# EAGLE design amp128-v5 (EAGLE 6.4)
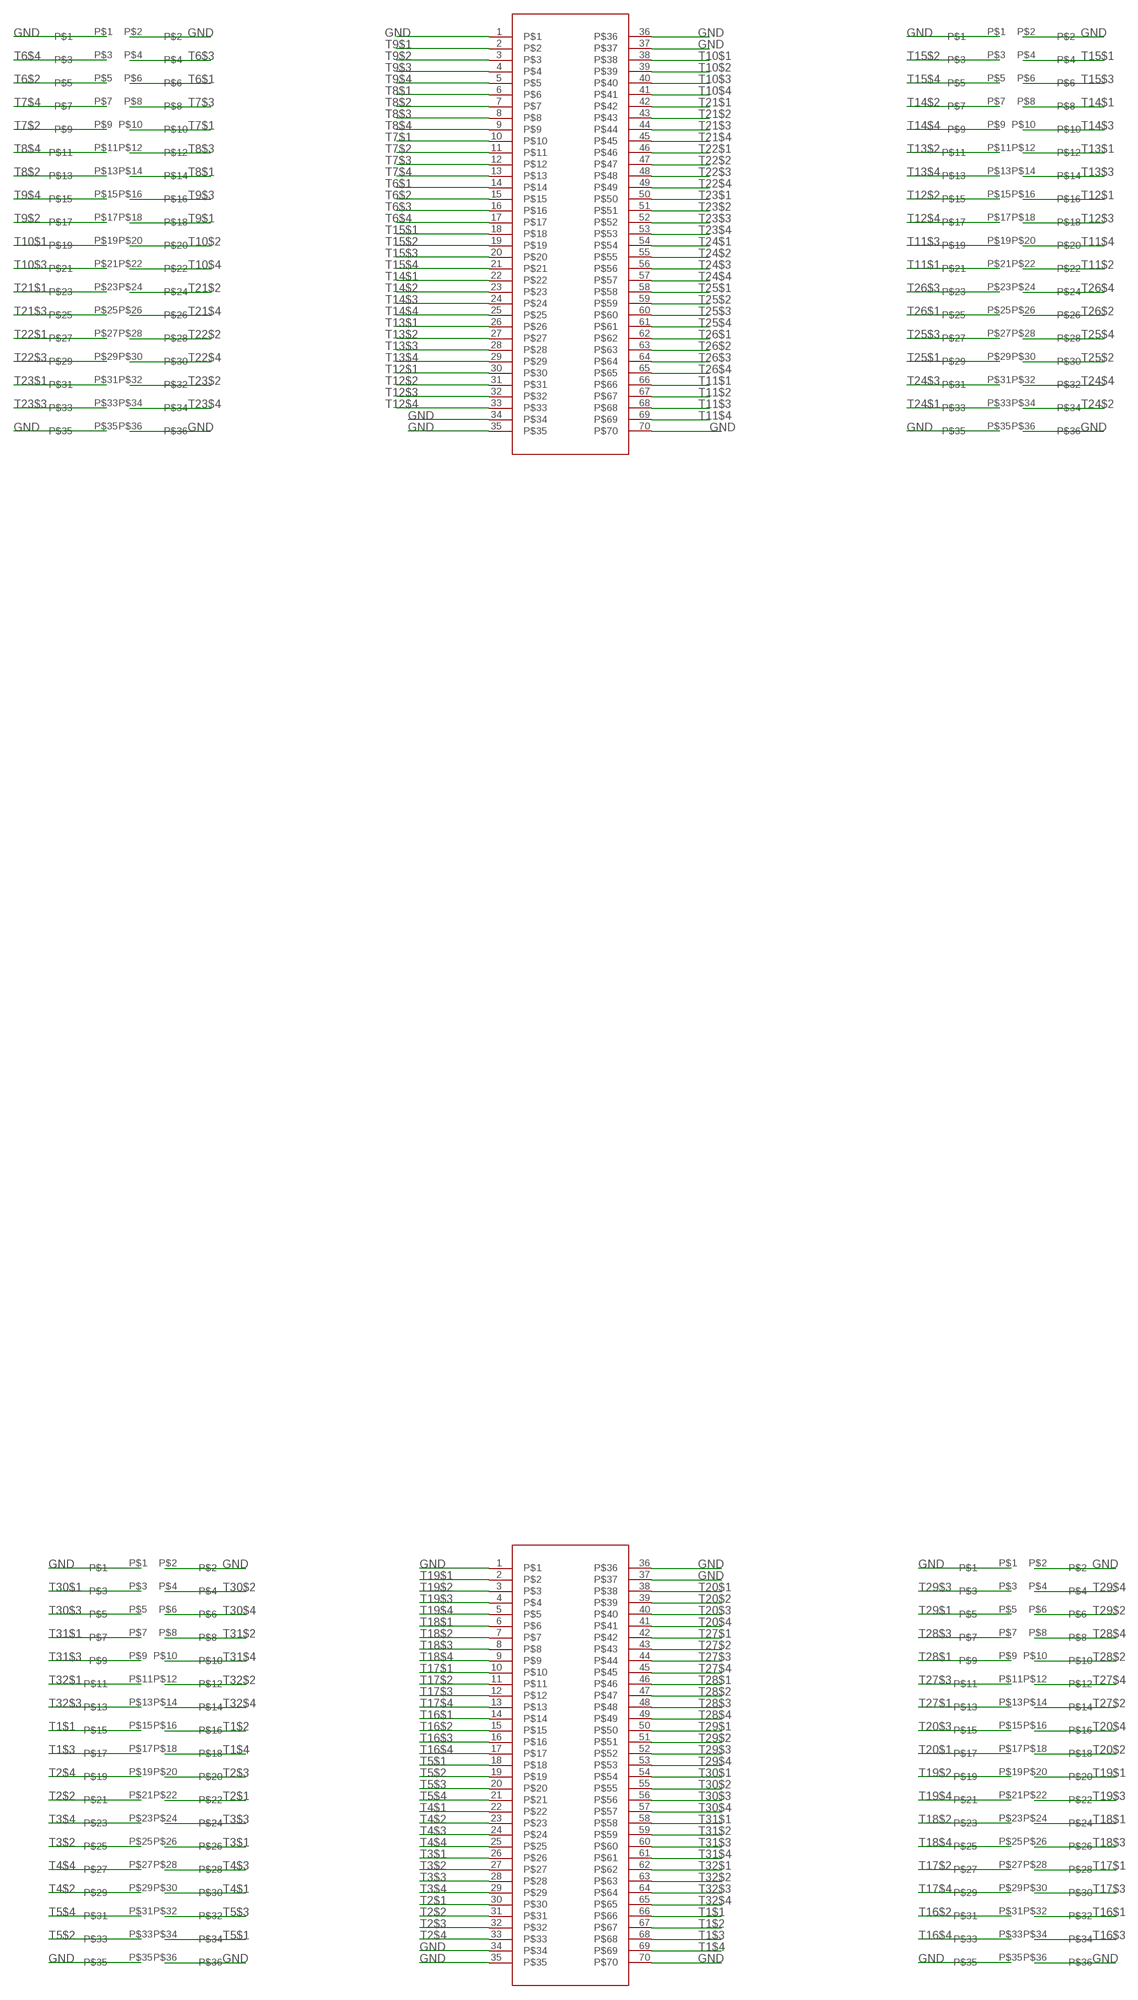
[diagram p0: schematic, sheet 1]

## Parts
U$1  DF40C-70DS  [DF40C-70DS]
U$2  DF40C-70DS  [DF40C-70DS]
U$3  MILL-MAX2BY18  [MILL-MAX2BY18]
U$4  MILL-MAX2BY18  [MILL-MAX2BY18]
U$5  MILL-MAX2BY18  [MILL-MAX2BY18]
U$6  MILL-MAX2BY18  [MILL-MAX2BY18]

## Nets
GND: U$1.1 U$1.34 U$1.35 U$1.36 U$1.37 U$1.70 U$2.1 U$2.34 U$2.35 U$2.36 U$2.37 U$2.70 U$3.P$1 U$3.P$2 U$3.P$35 U$3.P$36 U$4.P$1 U$4.P$2 U$4.P$35 U$4.P$36 U$5.P$1 U$5.P$2 U$5.P$35 U$5.P$36 U$6.P$1 U$6.P$2 U$6.P$35 U$6.P$36
T1$1: U$2.66 U$5.P$15
T1$2: U$2.67 U$5.P$16
T1$3: U$2.68 U$5.P$17
T1$4: U$2.69 U$5.P$18
T2$1: U$2.30 U$5.P$22
T2$2: U$2.31 U$5.P$21
T2$3: U$2.32 U$5.P$20
T2$4: U$2.33 U$5.P$19
T3$1: U$2.26 U$5.P$26
T3$2: U$2.27 U$5.P$25
T3$3: U$2.28 U$5.P$24
T3$4: U$2.29 U$5.P$23
T4$1: U$2.22 U$5.P$30
T4$2: U$2.23 U$5.P$29
T4$3: U$2.24 U$5.P$28
T4$4: U$2.25 U$5.P$27
T5$1: U$2.18 U$5.P$34
T5$2: U$2.19 U$5.P$33
T5$3: U$2.20 U$5.P$32
T5$4: U$2.21 U$5.P$31
T6$1: U$1.14 U$3.P$6
T6$2: U$1.15 U$3.P$5
T6$3: U$1.16 U$3.P$4
T6$4: U$1.17 U$3.P$3
T7$1: U$1.10 U$3.P$10
T7$2: U$1.11 U$3.P$9
T7$3: U$1.12 U$3.P$8
T7$4: U$1.13 U$3.P$7
T8$1: U$1.6 U$3.P$14
T8$2: U$1.7 U$3.P$13
T8$3: U$1.8 U$3.P$12
T8$4: U$1.9 U$3.P$11
T9$1: U$1.2 U$3.P$18
T9$2: U$1.3 U$3.P$17
T9$3: U$1.4 U$3.P$16
T9$4: U$1.5 U$3.P$15
T10$1: U$1.38 U$3.P$19
T10$2: U$1.39 U$3.P$20
T10$3: U$1.40 U$3.P$21
T10$4: U$1.41 U$3.P$22
T11$1: U$1.66 U$4.P$21
T11$2: U$1.67 U$4.P$22
T11$3: U$1.68 U$4.P$19
T11$4: U$1.69 U$4.P$20
T12$1: U$1.30 U$4.P$16
T12$2: U$1.31 U$4.P$15
T12$3: U$1.32 U$4.P$18
T12$4: U$1.33 U$4.P$17
T13$1: U$1.26 U$4.P$12
T13$2: U$1.27 U$4.P$11
T13$3: U$1.28 U$4.P$14
T13$4: U$1.29 U$4.P$13
T14$1: U$1.22 U$4.P$8
T14$2: U$1.23 U$4.P$7
T14$3: U$1.24 U$4.P$10
T14$4: U$1.25 U$4.P$9
T15$1: U$1.18 U$4.P$4
T15$2: U$1.19 U$4.P$3
T15$3: U$1.20 U$4.P$6
T15$4: U$1.21 U$4.P$5
T16$1: U$2.14 U$6.P$32
T16$2: U$2.15 U$6.P$31
T16$3: U$2.16 U$6.P$34
T16$4: U$2.17 U$6.P$33
T17$1: U$2.10 U$6.P$28
T17$2: U$2.11 U$6.P$27
T17$3: U$2.12 U$6.P$30
T17$4: U$2.13 U$6.P$29
T18$1: U$2.6 U$6.P$24
T18$2: U$2.7 U$6.P$23
T18$3: U$2.8 U$6.P$26
T18$4: U$2.9 U$6.P$25
T19$1: U$2.2 U$6.P$20
T19$2: U$2.3 U$6.P$19
T19$3: U$2.4 U$6.P$22
T19$4: U$2.5 U$6.P$21
T20$1: U$2.38 U$6.P$17
T20$2: U$2.39 U$6.P$18
T20$3: U$2.40 U$6.P$15
T20$4: U$2.41 U$6.P$16
T21$1: U$1.42 U$3.P$23
T21$2: U$1.43 U$3.P$24
T21$3: U$1.44 U$3.P$25
T21$4: U$1.45 U$3.P$26
T22$1: U$1.46 U$3.P$27
T22$2: U$1.47 U$3.P$28
T22$3: U$1.48 U$3.P$29
T22$4: U$1.49 U$3.P$30
T23$1: U$1.50 U$3.P$31
T23$2: U$1.51 U$3.P$32
T23$3: U$1.52 U$3.P$33
T23$4: U$1.53 U$3.P$34
T24$1: U$1.54 U$4.P$33
T24$2: U$1.55 U$4.P$34
T24$3: U$1.56 U$4.P$31
T24$4: U$1.57 U$4.P$32
T25$1: U$1.58 U$4.P$29
T25$2: U$1.59 U$4.P$30
T25$3: U$1.60 U$4.P$27
T25$4: U$1.61 U$4.P$28
T26$1: U$1.62 U$4.P$25
T26$2: U$1.63 U$4.P$26
T26$3: U$1.64 U$4.P$23
T26$4: U$1.65 U$4.P$24
T27$1: U$2.42 U$6.P$13
T27$2: U$2.43 U$6.P$14
T27$3: U$2.44 U$6.P$11
T27$4: U$2.45 U$6.P$12
T28$1: U$2.46 U$6.P$9
T28$2: U$2.47 U$6.P$10
T28$3: U$2.48 U$6.P$7
T28$4: U$2.49 U$6.P$8
T29$1: U$2.50 U$6.P$5
T29$2: U$2.51 U$6.P$6
T29$3: U$2.52 U$6.P$3
T29$4: U$2.53 U$6.P$4
T30$1: U$2.54 U$5.P$3
T30$2: U$2.55 U$5.P$4
T30$3: U$2.56 U$5.P$5
T30$4: U$2.57 U$5.P$6
T31$1: U$2.58 U$5.P$7
T31$2: U$2.59 U$5.P$8
T31$3: U$2.60 U$5.P$9
T31$4: U$2.61 U$5.P$10
T32$1: U$2.62 U$5.P$11
T32$2: U$2.63 U$5.P$12
T32$3: U$2.64 U$5.P$13
T32$4: U$2.65 U$5.P$14

## Library data of the parts
U$1 U$2 = saanlima:DF40C-70DS
U$3-U$6 = drive-parts:MILL-MAX2BY18

## Board
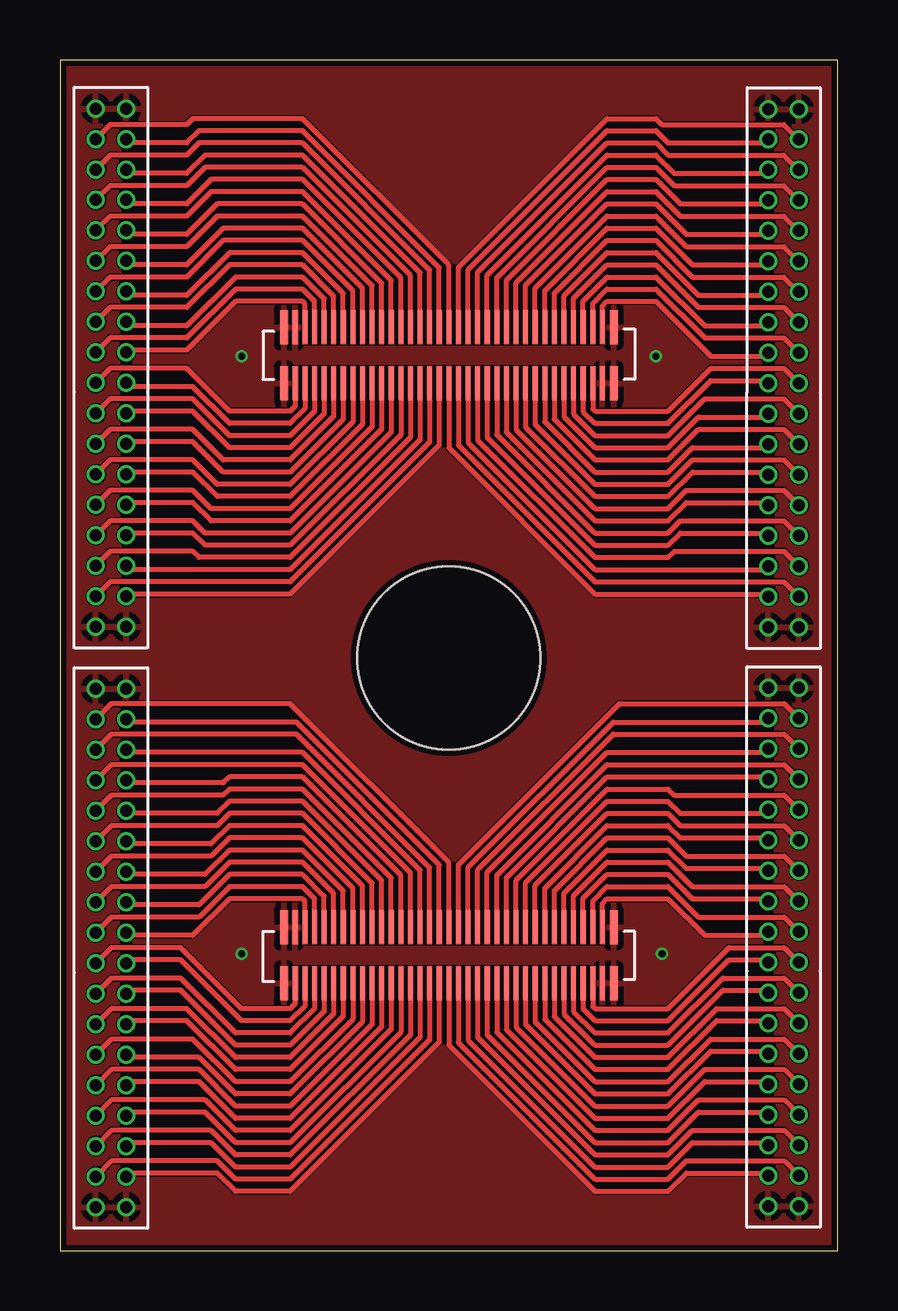
[diagram p1: board, top side]
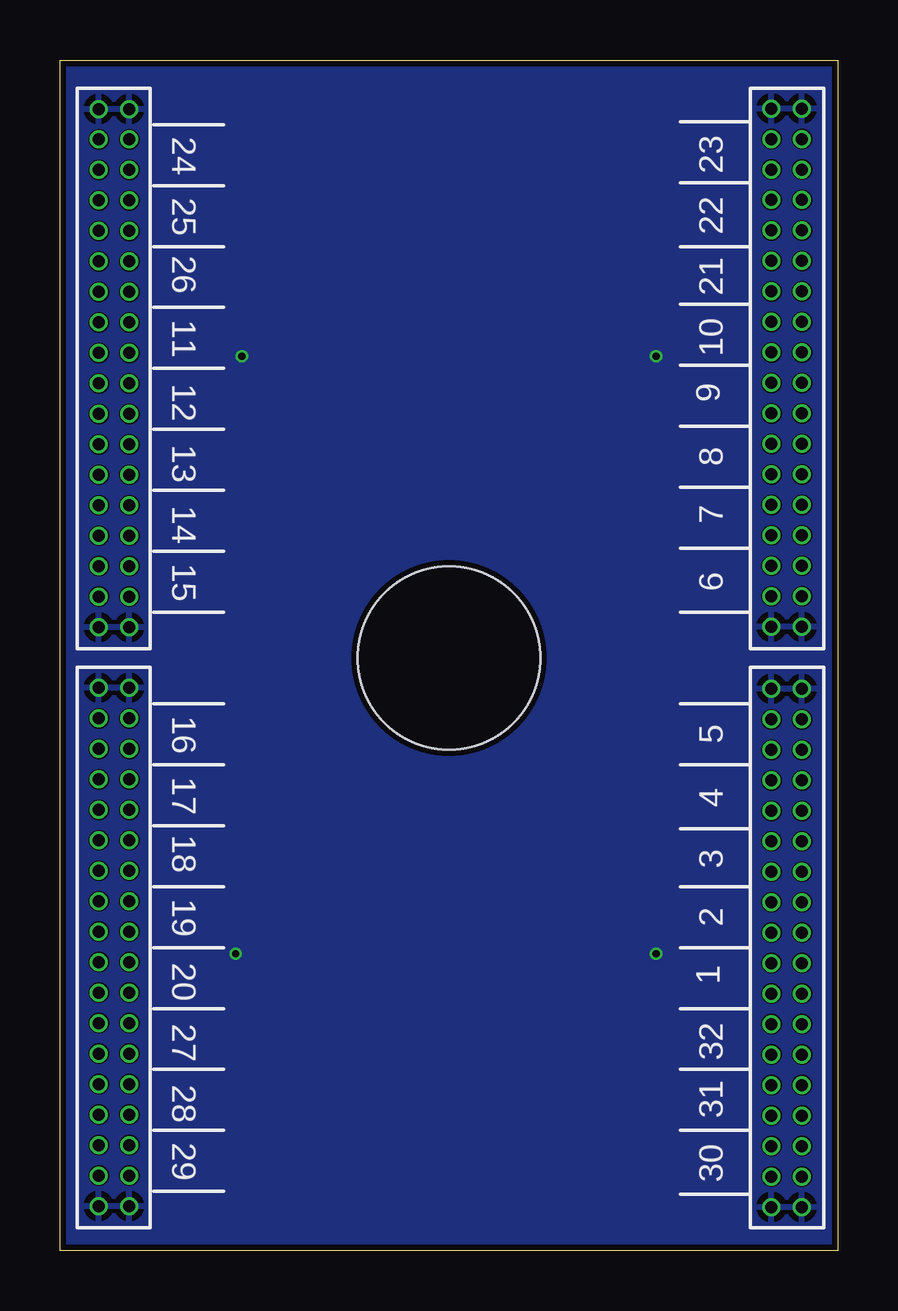
[diagram p2: board, bottom side, seen from below]

Size 32.42 x 49.61 mm. Coordinates in mm from the lower left corner, seen from the top.
Outline: 0,0 32.42,0 32.42,49.61 0,49.61 0,0
Copper layers (1*16): Top 0.035mm / dielectric 1.5mm / Bottom 0.035mm
Design rules "default *": minimum track width 2mil, minimum drill 6mil, track to track 2mil, track to pad 2mil, pad to pad 2mil, via to via 2mil, smd to smd 2mil, copper to edge 10mil, drill to drill 8mil, minimum pad ring 4mil, minimum via ring 4mil, stop-mask expansion 1.5mil, vias tented up to drill 0mil, thermal gap 10mil
Holes 7.62 mm at 16.21,24.7

### Footprints (pad centres in the part's own frame; a part is rotated, then mirrored left to right if it is on the bottom)
DF40C-70DS = smd 0.33 x 1.42: 1 -6.875,-1.17; 35 6.875,-1.17; 36 -6.875,1.17; 70 6.875,1.17 | smd 0.21 x 1.42: 2 -6.4,-1.17; 3 -6,-1.17; 4 -5.6,-1.17; 5 -5.2,-1.17; 6 -4.8,-1.17; 7 -4.4,-1.17; 8 -4,-1.17; 9 -3.6,-1.17; 10 -3.2,-1.17; 11 -2.8,-1.17; 12 -2.4,-1.17; 13 -2,-1.17; 14 -1.6,-1.17; 15 -1.2,-1.17; 16 -0.8,-1.17; 17 -0.4,-1.17; 18 0,-1.17; 19 0.4,-1.17; 20 0.8,-1.17; 21 1.2,-1.17; 22 1.6,-1.17; 23 2,-1.17; 24 2.4,-1.17; 25 2.8,-1.17; 26 3.2,-1.17; 27 3.6,-1.17; 28 4,-1.17; 29 4.4,-1.17; 30 4.8,-1.17; 31 5.2,-1.17; 32 5.6,-1.17; 33 6,-1.17; 34 6.4,-1.17; 37 -6.4,1.17; 38 -6,1.17; 39 -5.6,1.17; 40 -5.2,1.17; 41 -4.8,1.17; 42 -4.4,1.17; 43 -4,1.17; 44 -3.6,1.17; 45 -3.2,1.17; 46 -2.8,1.17; 47 -2.4,1.17; 48 -2,1.17; 49 -1.6,1.17; 50 -1.2,1.17; 51 -0.8,1.17; 52 -0.4,1.17; 53 0,1.17; 54 0.4,1.17; 55 0.8,1.17; 56 1.2,1.17; 57 1.6,1.17; 58 2,1.17; 59 2.4,1.17; 60 2.8,1.17; 61 3.2,1.17; 62 3.6,1.17; 63 4,1.17; 64 4.4,1.17; 65 4.8,1.17; 66 5.2,1.17; 67 5.6,1.17; 68 6,1.17; 69 6.4,1.17
MILL-MAX2BY18 = drill 0.5 pad 0.61: P$1 -10.795,-0.635; P$2 -10.795,0.635; P$3 -9.525,-0.635; P$4 -9.525,0.635; P$5 -8.255,-0.635; P$6 -8.255,0.635; P$7 -6.985,-0.635; P$8 -6.985,0.635; P$9 -5.715,-0.635; P$10 -5.715,0.635; P$11 -4.445,-0.635; P$12 -4.445,0.635; P$13 -3.175,-0.635; P$14 -3.175,0.635; P$15 -1.905,-0.635; P$16 -1.905,0.635; P$17 -0.635,-0.635; P$18 -0.635,0.635; P$19 0.635,-0.635; P$20 0.635,0.635; P$21 1.905,-0.635; P$22 1.905,0.635; P$23 3.175,-0.635; P$24 3.175,0.635; P$25 4.445,-0.635; P$26 4.445,0.635; P$27 5.715,-0.635; P$28 5.715,0.635; P$29 6.985,-0.635; P$30 6.985,0.635; P$31 8.255,-0.635; P$32 8.255,0.635; P$33 9.525,-0.635; P$34 9.525,0.635; P$35 10.795,-0.635; P$36 10.795,0.635

### Placement (x,y rotation side)
U$1  16.21,37.31 0 top
U$2  16.21,12.31 180 top
U$3  2.13,36.79 90 top
U$4  30.17,36.77 90 top
U$5  2.13,12.61 90 top
U$6  30.17,12.66 90 top

### Tracks (layer width: path | path; a pad name or v marks a point on that pad's centre or on a via)
GND  (via drill 0.3 pad 0.3)
  other vias: 7.57,37.27 24.84,37.27 25.1,12.38 7.57,12.38
  pour Bottom: 0.21,49.46 0.21,0.18 32.21,0.18 32.21,49.46
  pour Top: 32.21,49.46 0.21,49.46 0.21,0.18 32.21,0.18
T1$1
  Top 0.203: U$2.66 11.01,9.97 9.6,8.57 7.32,8.57 5.03,10.85 2.9,10.85 U$5.P$15
T1$2
  Top 0.203: U$2.67 10.61,10.08 9.6,9.07 7.32,9.07 5.03,11.36 2.14,11.36 U$5.P$16
T1$3
  Top 0.203: U$2.68 10.21,10.19 9.6,9.58 7.57,9.58 5.03,12.12 2.9,12.12 U$5.P$17
T1$4
  Top 0.203: U$2.69 9.81,10.3 9.6,10.09 7.57,10.09 5.03,12.63 2.14,12.63 U$5.P$18
T2$1
  Top 0.203: U$2.30 11.41,14.89 10.11,16.19 7.06,16.19 6.05,15.17 2.14,15.17 U$5.P$22
T2$2
  Top 0.203: U$2.31 11.01,14.78 10.11,15.68 7.06,15.68 5.79,14.41 2.87,14.41 U$5.P$21
T2$3
  Top 0.203: U$2.32 10.61,14.67 10.11,15.17 7.06,15.17 5.79,13.9 2.14,13.9 U$5.P$20
T2$4
  Top 0.203: U$2.33 10.21,14.56 10.11,14.66 7.06,14.66 5.54,13.14 2.87,13.14 U$5.P$19
T3$1
  Top 0.203: U$2.26 13.01,15.32 10.11,18.22 7.06,18.22 6.56,17.71 2.14,17.71 U$5.P$26
T3$2
  Top 0.203: U$2.27 12.61,15.21 10.11,17.71 7.06,17.71 6.3,16.95 2.87,16.95 U$5.P$25
T3$3
  Top 0.203: U$2.28 12.21,15.1 10.11,17.2 7.06,17.2 6.3,16.44 2.14,16.44 U$5.P$24
T3$4
  Top 0.203: U$2.29 11.81,14.99 10.11,16.69 7.06,16.69 6.05,15.68 2.87,15.68 U$5.P$23
T4$1
  Top 0.203: U$2.22 14.61,15.75 10.11,20.25 2.14,20.25 U$5.P$30
T4$2
  Top 0.203: U$2.23 14.21,15.64 10.11,19.74 7.06,19.74 6.81,19.49 2.87,19.49 U$5.P$29
T4$3
  Top 0.203: U$2.24 13.81,15.53 10.11,19.23 7.06,19.23 6.81,18.98 2.14,18.98 U$5.P$28
T4$4
  Top 0.203: U$2.25 13.41,15.43 10.11,18.73 7.06,18.73 6.56,18.22 2.87,18.22 U$5.P$27
T5$1
  Top 0.203: U$2.18 16.21,16.18 9.6,22.79 2.14,22.79 U$5.P$34
T5$2
  Top 0.203: U$2.19 15.81,16.07 9.86,22.03 2.87,22.03 U$5.P$33
T5$3
  Top 0.203: U$2.20 15.41,15.97 9.86,21.52 2.14,21.52 U$5.P$32
T5$4
  Top 0.203: U$2.21 15.01,15.86 10.11,20.76 2.87,20.76 U$5.P$31
T6$1
  Top 0.203: U$1.14 14.61,33.89 9.6,28.89 5.79,28.89 5.54,29.14 2.09,29.14 U$3.P$6
T6$2
  Top 0.203: U$1.15 15.01,33.79 9.6,28.38 2.92,28.38 U$3.P$5
T6$3
  Top 0.203: U$1.16 15.41,33.68 9.6,27.87 2.09,27.87 U$3.P$4
T6$4
  Top 0.203: U$1.17 15.81,33.57 9.6,27.36 2.85,27.36 U$3.P$3
T7$1
  Top 0.203: U$1.10 13.01,34.33 9.6,30.92 6.3,30.92 5.54,31.68 2.09,31.68 U$3.P$10
T7$2
  Top 0.203: U$1.11 13.41,34.22 9.6,30.41 6.3,30.41 5.54,31.17 2.85,31.17 U$3.P$9
T7$3
  Top 0.203: U$1.12 13.81,34.11 9.6,29.9 6.05,29.9 5.54,30.41 2.09,30.41 U$3.P$8
T7$4
  Top 0.203: U$1.13 14.21,34 9.6,29.39 6.05,29.39 5.54,29.9 2.85,29.9 U$3.P$7
T8$1
  Top 0.203: U$1.6 11.41,34.76 9.6,32.95 6.81,32.95 5.54,34.22 2.09,34.22 U$3.P$14
T8$2
  Top 0.203: U$1.7 11.81,34.65 9.6,32.44 6.81,32.44 5.54,33.71 2.85,33.71 U$3.P$13
T8$3
  Top 0.203: U$1.8 12.21,34.54 9.6,31.93 6.56,31.93 5.54,32.95 2.09,32.95 U$3.P$12
T8$4
  Top 0.203: U$1.9 12.61,34.43 9.6,31.43 6.56,31.43 5.54,32.44 2.85,32.44 U$3.P$11
T9$1
  Top 0.203: U$1.2 9.81,35.19 9.6,34.98 7.06,34.98 5.29,36.76 2.09,36.76 U$3.P$18
T9$2
  Top 0.203: U$1.3 10.21,35.08 9.6,34.47 7.06,34.47 5.54,36 2.92,36 U$3.P$17
T9$3
  Top 0.203: U$1.4 10.61,34.97 9.6,33.97 7.06,33.97 5.54,35.49 2.09,35.49 U$3.P$16
T9$4
  Top 0.203: U$1.5 11.01,34.87 9.6,33.46 7.06,33.46 5.54,34.98 2.85,34.98 U$3.P$15
T10$1
  Top 0.203: U$1.38 10.21,39.45 10.11,39.55 7.32,39.55 5.29,37.52 2.85,37.52 U$3.P$19
T10$2
  Top 0.203: U$1.39 10.61,39.56 10.11,40.06 7.32,40.06 5.29,38.03 2.09,38.03 U$3.P$20
T10$3
  Top 0.203: U$1.40 11.01,39.67 10.11,40.57 7.32,40.57 5.29,38.54 2.92,38.54 U$3.P$21
T10$4
  Top 0.203: U$1.41 11.41,39.78 10.11,41.08 7.06,41.08 5.29,39.3 2.09,39.3 U$3.P$22
T11$1
  Top 0.203: U$1.66 21.41,39.68 22.81,41.08 24.84,41.08 26.62,39.3 30.19,39.3 U$4.P$21
T11$2
  Top 0.203: U$1.67 21.81,39.57 22.81,40.57 24.84,40.57 26.88,38.54 29.39,38.54 U$4.P$22
T11$3
  Top 0.203: U$1.68 22.21,39.46 22.81,40.06 24.84,40.06 26.88,38.03 30.19,38.03 U$4.P$19
T11$4
  Top 0.203: U$1.69 22.61,39.35 22.81,39.55 24.84,39.55 27.13,37.27 29.39,37.27 U$4.P$20
T12$1
  Top 0.203: U$1.30 21.01,34.75 22.3,33.46 25.35,33.46 26.62,34.73 29.39,34.73 U$4.P$16
T12$2
  Top 0.203: U$1.31 21.41,34.86 22.3,33.97 25.35,33.97 26.88,35.49 30.19,35.49 U$4.P$15
T12$3
  Top 0.203: U$1.32 21.81,34.97 22.3,34.47 25.35,34.47 27.13,36.25 29.42,36.25 U$4.P$18
T12$4
  Top 0.203: U$1.33 22.21,35.07 22.3,34.98 25.35,34.98 27.13,36.76 30.19,36.76 U$4.P$17
T13$1
  Top 0.203: U$1.26 19.41,34.32 22.3,31.43 25.35,31.43 26.37,32.44 29.42,32.44 U$4.P$12
T13$2
  Top 0.203: U$1.27 19.81,34.43 22.3,31.93 25.35,31.93 26.37,32.95 30.19,32.95 U$4.P$11
T13$3
  Top 0.203: U$1.28 20.21,34.53 22.3,32.44 25.35,32.44 26.37,33.46 29.39,33.46 U$4.P$14
T13$4
  Top 0.203: U$1.29 20.61,34.64 22.3,32.95 25.35,32.95 26.62,34.22 30.19,34.22 U$4.P$13
T14$1
  Top 0.203: U$1.22 17.81,33.89 22.3,29.39 25.35,29.39 25.86,29.9 29.42,29.9 U$4.P$8
T14$2
  Top 0.203: U$1.23 18.21,33.99 22.3,29.9 25.35,29.9 25.86,30.41 30.19,30.41 U$4.P$7
T14$3
  Top 0.203: U$1.24 18.61,34.1 22.3,30.41 25.35,30.41 26.11,31.17 29.42,31.17 U$4.P$10
T14$4
  Top 0.203: U$1.25 19.01,34.21 22.3,30.92 25.35,30.92 26.11,31.68 30.19,31.68 U$4.P$9
T15$1
  Top 0.203: U$1.18 16.21,33.45 22.3,27.36 29.42,27.36 U$4.P$4
T15$2
  Top 0.203: U$1.19 16.61,33.56 22.3,27.87 30.19,27.87 U$4.P$3
T15$3
  Top 0.203: U$1.20 17.01,33.67 22.3,28.38 29.39,28.38 U$4.P$6
T15$4
  Top 0.203: U$1.21 17.41,33.78 22.3,28.89 25.35,28.89 25.61,29.14 30.19,29.14 U$4.P$5
T16$1
  Top 0.203: U$2.14 17.81,15.76 22.81,20.76 29.38,20.76 U$6.P$32
T16$2
  Top 0.203: U$2.15 17.41,15.87 23.07,21.52 30.2,21.52 U$6.P$31
T16$3
  Top 0.203: U$2.16 17.01,15.97 23.07,22.03 29.38,22.03 U$6.P$34
T16$4
  Top 0.203: U$2.17 16.61,16.08 23.32,22.79 30.2,22.79 U$6.P$33
T17$1
  Top 0.203: U$2.10 19.41,15.33 22.81,18.73 25.35,18.73 25.86,18.22 29.38,18.22 U$6.P$28
T17$2
  Top 0.203: U$2.11 19.01,15.43 22.81,19.23 25.35,19.23 25.61,18.98 30.2,18.98 U$6.P$27
T17$3
  Top 0.203: U$2.12 18.61,15.54 22.81,19.74 29.43,19.74 U$6.P$30
T17$4
  Top 0.203: U$2.13 18.21,15.65 22.81,20.25 30.2,20.25 U$6.P$29
T18$1
  Top 0.203: U$2.6 21.01,14.89 22.81,16.69 25.35,16.69 26.11,15.93 29.43,15.93 U$6.P$24
T18$2
  Top 0.203: U$2.7 20.61,15 22.81,17.2 25.35,17.2 26.11,16.44 30.2,16.44 U$6.P$23
T18$3
  Top 0.203: U$2.8 20.21,15.11 22.81,17.71 25.35,17.71 25.86,17.2 29.43,17.2 U$6.P$26
T18$4
  Top 0.203: U$2.9 19.81,15.22 22.81,18.22 25.35,18.22 25.86,17.71 30.2,17.71 U$6.P$25
T19$1
  Top 0.203: U$2.2 22.61,14.46 22.81,14.66 25.35,14.66 26.88,13.14 29.38,13.14 U$6.P$20
T19$2
  Top 0.203: U$2.3 22.21,14.57 22.81,15.17 25.35,15.17 26.62,13.9 30.2,13.9 U$6.P$19
T19$3
  Top 0.203: U$2.4 21.81,14.68 22.81,15.68 25.35,15.68 26.37,14.66 29.43,14.66 U$6.P$22
T19$4
  Top 0.203: U$2.5 21.41,14.79 22.81,16.19 25.35,16.19 26.37,15.17 30.2,15.17 U$6.P$21
T20$1
  Top 0.203: U$2.38 22.21,10.18 22.3,10.09 25.35,10.09 27.89,12.63 30.2,12.63 U$6.P$17
T20$2
  Top 0.203: U$2.39 21.81,10.07 22.3,9.58 25.35,9.58 27.89,12.12 29.43,12.12 U$6.P$18
T20$3
  Top 0.203: U$2.40 21.41,9.97 22.3,9.07 25.35,9.07 27.64,11.36 30.2,11.36 U$6.P$15
T20$4
  Top 0.203: U$2.41 21.01,9.86 22.3,8.57 25.35,8.57 27.64,10.85 29.43,10.85 U$6.P$16
T21$1
  Top 0.203: U$1.42 11.81,39.89 10.11,41.59 7.06,41.59 5.29,39.81 2.92,39.81 U$3.P$23
T21$2
  Top 0.203: U$1.43 12.21,39.99 10.11,42.09 6.81,42.09 5.29,40.57 2.09,40.57 U$3.P$24
T21$3
  Top 0.203: U$1.44 12.61,40.1 10.11,42.6 6.81,42.6 5.29,41.08 2.92,41.08 U$3.P$25
T21$4
  Top 0.203: U$1.45 13.01,40.21 10.11,43.11 6.56,43.11 5.29,41.84 2.09,41.84 U$3.P$26
T22$1
  Top 0.203: U$1.46 13.41,40.32 10.11,43.62 6.56,43.62 5.29,42.35 2.92,42.35 U$3.P$27
T22$2
  Top 0.203: U$1.47 13.81,40.43 10.11,44.13 6.3,44.13 5.29,43.11 2.09,43.11 U$3.P$28
T22$3
  Top 0.203: U$1.48 14.21,40.53 10.11,44.63 6.3,44.63 5.29,43.62 2.92,43.62 U$3.P$29
T22$4
  Top 0.203: U$1.49 14.61,40.64 10.11,45.14 6.05,45.14 5.29,44.38 2.09,44.38 U$3.P$30
T23$1
  Top 0.203: U$1.50 15.01,40.75 10.11,45.65 6.05,45.65 5.29,44.89 2.92,44.89 U$3.P$31
T23$2
  Top 0.203: U$1.51 15.41,40.86 10.11,46.16 5.79,46.16 5.29,45.65 2.09,45.65 U$3.P$32
T23$3
  Top 0.203: U$1.52 15.81,40.97 10.11,46.67 5.79,46.67 5.29,46.16 2.92,46.16 U$3.P$33
T23$4
  Top 0.203: U$1.53 16.21,41.07 10.11,47.17 5.54,47.17 5.29,46.92 2.09,46.92 U$3.P$34
T24$1
  Top 0.203: U$1.54 16.61,40.97 22.81,47.17 24.84,47.17 25.1,46.92 30.19,46.92 U$4.P$33
T24$2
  Top 0.203: U$1.55 17.01,40.87 22.81,46.67 24.84,46.67 25.35,46.16 29.39,46.16 U$4.P$34
T24$3
  Top 0.203: U$1.56 17.41,40.76 22.81,46.16 24.84,46.16 25.35,45.65 30.19,45.65 U$4.P$31
T24$4
  Top 0.203: U$1.57 17.81,40.65 22.81,45.65 24.84,45.65 25.61,44.89 29.39,44.89 U$4.P$32
T25$1
  Top 0.203: U$1.58 18.21,40.54 22.81,45.14 24.84,45.14 25.61,44.38 30.19,44.38 U$4.P$29
T25$2
  Top 0.203: U$1.59 18.61,40.43 22.81,44.63 24.84,44.63 25.86,43.62 29.39,43.62 U$4.P$30
T25$3
  Top 0.203: U$1.60 19.01,40.33 22.81,44.13 24.84,44.13 25.86,43.11 30.19,43.11 U$4.P$27
T25$4
  Top 0.203: U$1.61 19.41,40.22 22.81,43.62 24.84,43.62 26.11,42.35 29.39,42.35 U$4.P$28
T26$1
  Top 0.203: U$1.62 19.81,40.11 22.81,43.11 24.84,43.11 26.11,41.84 30.19,41.84 U$4.P$25
T26$2
  Top 0.203: U$1.63 20.21,40 22.81,42.6 24.84,42.6 26.37,41.08 29.39,41.08 U$4.P$26
T26$3
  Top 0.203: U$1.64 20.61,39.89 22.81,42.09 24.84,42.09 26.37,40.57 30.19,40.57 U$4.P$23
T26$4
  Top 0.203: U$1.65 21.01,39.79 22.81,41.59 24.84,41.59 26.62,39.81 29.39,39.81 U$4.P$24
T27$1
  Top 0.203: U$2.42 20.61,9.75 22.3,8.06 25.35,8.06 27.38,10.09 30.2,10.09 U$6.P$13
T27$2
  Top 0.203: U$2.43 20.21,9.64 22.3,7.55 25.35,7.55 27.38,9.58 29.43,9.58 U$6.P$14
T27$3
  Top 0.203: U$2.44 19.81,9.53 22.3,7.04 25.35,7.04 27.13,8.82 30.2,8.82 U$6.P$11
T27$4
  Top 0.203: U$2.45 19.41,9.43 22.3,6.53 25.35,6.53 27.13,8.31 29.43,8.31 U$6.P$12
T28$1
  Top 0.203: U$2.46 19.01,9.32 22.3,6.03 25.35,6.03 26.88,7.55 30.2,7.55 U$6.P$9
T28$2
  Top 0.203: U$2.47 18.61,9.21 22.3,5.52 25.35,5.52 26.88,7.04 29.43,7.04 U$6.P$10
T28$3
  Top 0.203: U$2.48 18.21,9.1 22.3,5.01 25.35,5.01 26.62,6.28 30.2,6.28 U$6.P$7
T28$4
  Top 0.203: U$2.49 17.81,8.99 22.3,4.5 25.35,4.5 26.62,5.77 29.43,5.77 U$6.P$8
T29$1
  Top 0.203: U$2.50 17.41,8.89 22.3,3.99 25.35,3.99 26.37,5.01 30.2,5.01 U$6.P$5
T29$2
  Top 0.203: U$2.51 17.01,8.78 22.3,3.49 25.35,3.49 26.37,4.5 29.43,4.5 U$6.P$6
T29$3
  Top 0.203: U$2.52 16.61,8.67 22.3,2.98 25.35,2.98 26.11,3.74 30.2,3.74 U$6.P$3
T29$4
  Top 0.203: U$2.53 16.21,8.56 22.3,2.47 25.35,2.47 26.11,3.23 29.43,3.23 U$6.P$4
T30$1
  Top 0.203: U$2.54 15.81,8.68 9.6,2.47 7.32,2.47 6.56,3.23 2.9,3.23 U$5.P$3
T30$2
  Top 0.203: U$2.55 15.41,8.79 9.6,2.98 7.32,2.98 6.56,3.74 2.14,3.74 U$5.P$4
T30$3
  Top 0.203: U$2.56 15.01,8.89 9.6,3.49 7.32,3.49 6.3,4.5 2.9,4.5 U$5.P$5
T30$4
  Top 0.203: U$2.57 14.61,9 9.6,3.99 7.32,3.99 6.3,5.01 2.14,5.01 U$5.P$6
T31$1
  Top 0.203: U$2.58 14.21,9.11 9.6,4.5 7.32,4.5 6.05,5.77 2.9,5.77 U$5.P$7
T31$2
  Top 0.203: U$2.59 13.81,9.22 9.6,5.01 7.32,5.01 6.05,6.28 2.14,6.28 U$5.P$8
T31$3
  Top 0.203: U$2.60 13.41,9.33 9.6,5.52 7.32,5.52 5.79,7.04 2.9,7.04 U$5.P$9
T31$4
  Top 0.203: U$2.61 13.01,9.43 9.6,6.03 7.32,6.03 5.79,7.55 2.14,7.55 U$5.P$10
T32$1
  Top 0.203: U$2.62 12.61,9.54 9.6,6.53 7.32,6.53 5.79,8.06 2.87,8.06 U$5.P$11
T32$2
  Top 0.203: U$2.63 12.21,9.65 9.6,7.04 7.32,7.04 5.54,8.82 2.14,8.82 U$5.P$12
T32$3
  Top 0.203: U$2.64 11.81,9.76 9.6,7.55 7.32,7.55 5.29,9.58 2.9,9.58 U$5.P$13
T32$4
  Top 0.203: U$2.65 11.41,9.87 9.6,8.06 7.32,8.06 5.29,10.09 2.14,10.09 U$5.P$14

### Text on the board
bPlace: 24 | 23 | 25 | 22 | 26 | 21 | 11 | 10 | 12 | 9 | 13 | 8 | 14 | 7 | 15 | 6 | 16 | 5 | 17 | 4 | 18 | 3 | 19 | 2 | 20 | 1 | 27 | 32 | 28 | 31 | 29 | 30